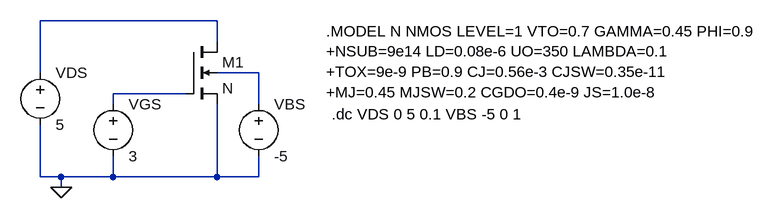
[diagram p0: schematic MOSFET-Body.asc]
MOSFET-Body.asc, the LTspice schematic file:
Version 4
SHEET 1 880 680
WIRE -64 -48 -336 -48
WIRE -64 -16 -64 -48
WIRE -336 32 -336 -48
WIRE 0 32 -64 32
WIRE -112 64 -224 64
WIRE -224 80 -224 64
WIRE 0 80 0 32
WIRE -336 192 -336 112
WIRE -304 192 -336 192
WIRE -224 192 -224 160
WIRE -224 192 -304 192
WIRE -64 192 -64 80
WIRE -64 192 -224 192
WIRE 0 192 0 160
WIRE 0 192 -64 192
WIRE -304 208 -304 192
FLAG -304 208 0
SYMBOL nmos4 -112 -16 R0
SYMATTR InstName M1
SYMATTR Value N
SYMATTR Value2 l=4u w=1u
SYMBOL voltage -336 16 R0
WINDOW 123 0 0 Left 0
WINDOW 39 0 0 Left 0
SYMATTR InstName VDS
SYMATTR Value 5
SYMBOL voltage -224 64 R0
WINDOW 123 0 0 Left 0
WINDOW 39 0 0 Left 0
SYMATTR InstName VGS
SYMATTR Value 3
SYMBOL voltage 0 64 R0
WINDOW 123 0 0 Left 0
WINDOW 39 0 0 Left 0
SYMATTR InstName VBS
SYMATTR Value -5
TEXT 104 -32 Left 2 !.MODEL N NMOS LEVEL=1 VTO=0.7 GAMMA=0.45 PHI=0.9\n+NSUB=9e14 LD=0.08e-6 UO=350 LAMBDA=0.1\n+TOX=9e-9 PB=0.9 CJ=0.56e-3 CJSW=0.35e-11\n+MJ=0.45 MJSW=0.2 CGDO=0.4e-9 JS=1.0e-8
TEXT 112 96 Left 2 !.dc VDS 0 5 0.1 VBS -5 0 1

The netlist it stands for:
* MOSFET-Body.asc
M1 N001 N003 0 N002 N l=4u w=1u
VDS N001 0 5
VGS N003 0 3
VBS N002 0 -5
.model NMOS NMOS
.model PMOS PMOS
.lib standard.mos
.MODEL N NMOS LEVEL=1 VTO=0.7 GAMMA=0.45 PHI=0.9
+NSUB=9e14 LD=0.08e-6 UO=350 LAMBDA=0.1
+TOX=9e-9 PB=0.9 CJ=0.56e-3 CJSW=0.35e-11
+MJ=0.45 MJSW=0.2 CGDO=0.4e-9 JS=1.0e-8
.dc VDS 0 5 0.1 VBS -5 0 1
.backanno
.end